# EAGLE design AstableMultivibrator-PNP-alt2 (EAGLE 7.6.0)
Forced quenching improves three-transistor FM tuner Lyle Williams -February 29, 2016 http://edn.com/design/diy/4441531/Forced-quenching-improves-three-transistor-FM-tuner
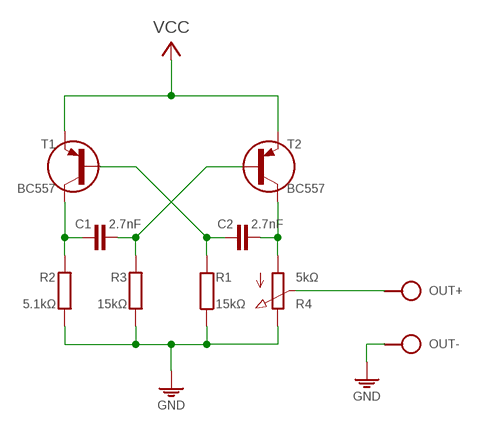
[diagram p0: schematic, sheet 1]

## Parts
C1  2.7nF  C-H075-020X044  [C075-020X044]
C2  2.7nF  C-H075-020X044  [C075-020X044]
J1  VCC_GNDPWR-L  [PWR-L]
OUT  SPAD+--+  [SPAD-+]
R1  15kΩ  R0202/7-V  [0202/7-V]
R2  5.1kΩ  R0202/7-V  [0202/7-V]
R3  15kΩ  R0202/7-V  [0202/7-V]
R4  5kΩ  POT-V  [POT-V]
T1  BC557  BC557CBE  [TO92-CBE]
T2  BC557  BC557CBE  [TO92-CBE]

## Nets
GND: J1.1 OUT.1 R1.1 R2.1 R3.1 R4.E
N$1: C2.2 R4.A T2.C
N$2: C1.1 R2.2 T1.C
N$3: C2.1 R1.2 T1.B
N$4: C1.2 R3.2 T2.B
N$6: OUT.2 R4.S
VCC: J1.2 T1.E T2.E

## Library data of the parts
C1 C2 = c:C-H
J1 = pad:VCC_GND
OUT = pad:SPAD+-
R1-R3 = r:R: RESISTOR, European symbol
R4 = r:POT
T1 T2 = t:BC557

## Net classes
0 default: width 0.61 mm

## Board
Forced quenching improves three-transistor FM tuner Lyle Williams -February 29, 2016 http://edn.com/design/diy/4441531/Forced-quenching-improves-three-transistor-FM-tuner
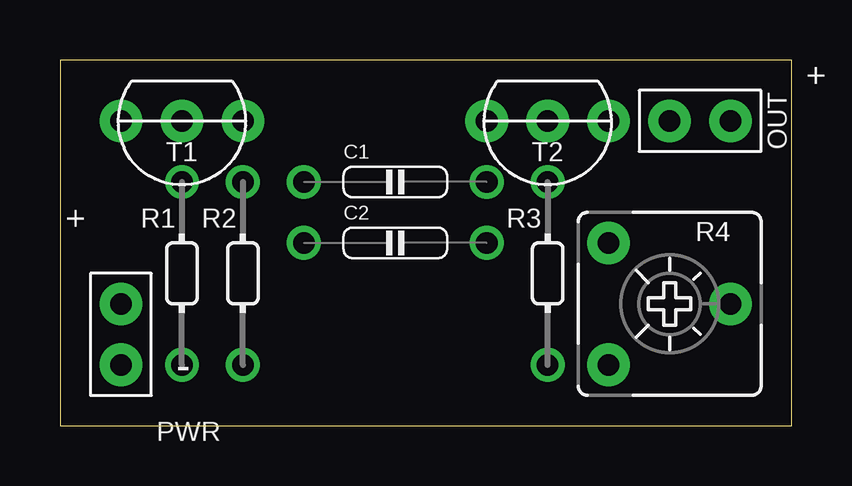
[diagram p1: board, top side]
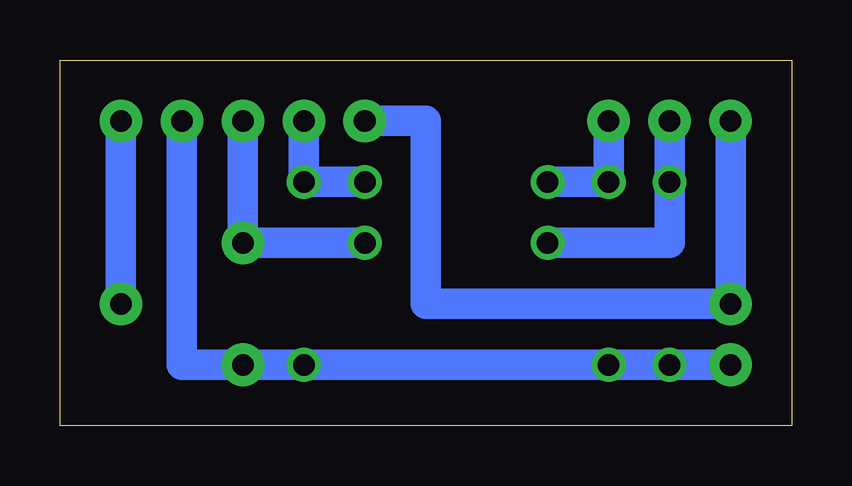
[diagram p2: board, bottom side, seen from below]

Size 30.48 x 15.24 mm. Coordinates in mm from the lower left corner, seen from the top.
Outline: 0,0 30.48,0 30.48,15.24 0,15.24 0,0
Copper layers (1*16): Top 0.035mm / dielectric 1.5mm / Bottom 0.035mm
Design rules "default": minimum track width 10mil, minimum drill 24mil, track to track 8mil, track to pad 8mil, pad to pad 8mil, via to via 8mil, smd to smd 8mil, copper to edge 40mil, drill to drill 8mil, minimum pad ring 10mil, minimum via ring 8mil, stop-mask expansion 4mil, vias tented up to drill 0mil, thermal gap 10mil

### Footprints (pad centres in the part's own frame; a part is rotated, then mirrored left to right if it is on the bottom)
C075-020X044 = drill 0.9: 1 -3.81,0; 2 3.81,0
PWR-L = drill 0.9 pad 1.778: 1 0,-1.27; 2 0,1.27
SPAD-+ = drill 0.9 pad 1.778: 1 0,-1.27; 2 0,1.27
0202/7-V = drill 0.9: 1 0,-3.81; 2 0,3.81
POT-V = drill 0.9 pad 1.778: A -2.54,-2.54; E 2.54,-2.54; S 0,2.54
TO92-CBE = drill 0.9 pad 1.778: B 0,0; C 0,2.54; E 0,-2.54

### Placement (x,y rotation side)
C1  13.97,10.16 0 top
C2  13.97,7.62 0 top
J1  2.54,3.81 0 top
OUT  26.67,12.7 270 top
R1  5.08,6.35 0 top
R2  7.62,6.35 0 top
R3  20.32,6.35 0 top
R4  25.4,5.08 270 top
T1  5.08,12.7 270 top
T2  20.32,12.7 270 top

### Tracks (layer width: path | path; a pad name or v marks a point on that pad's centre or on a via)
GND
  Bottom 1.27: J1.1 R1.1 R2.1 R3.1 R4.E 25.4,2.54 OUT.1
N$1
  Bottom 1.27: C2.2 R4.A T2.C
N$2
  Bottom 1.27: C1.1 R2.2 T1.C
N$3
  Bottom 1.27: C2.1 5.08,7.62 R1.2 T1.B
N$4
  Bottom 1.27: T2.B R3.2 C1.2
N$6
  Bottom 1.27: R4.S OUT.2
VCC
  Bottom 1.27: T2.E 15.24,12.7 15.24,5.08 J1.2 T1.E